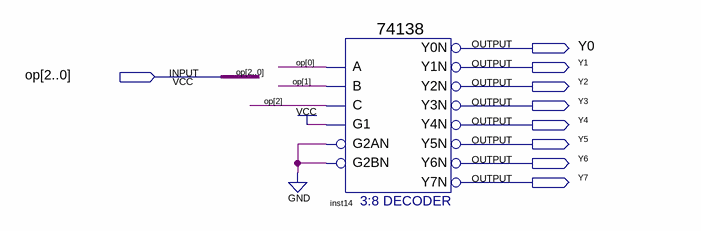
[diagram p0: schematic sheet]
// Quartus schematic 74138b.bdf as structural Verilog: 1 symbols, 9 pins
module \74138b  (
  input  [2:0] op,
  output Y0,
  output Y1,
  output Y2,
  output Y3,
  output Y4,
  output Y5,
  output Y6,
  output Y7
);

  \74138  inst14 (
    .A(op[0]), .B(op[1]), .G1(1'b1), .C(op[2]), .G2AN(1'b0), .G2BN(1'b0), .Y0N(Y0), .Y1N(Y1), .Y2N(Y2),
    .Y3N(Y3), .Y4N(Y4), .Y5N(Y5), .Y6N(Y6), .Y7N(Y7));
endmodule
